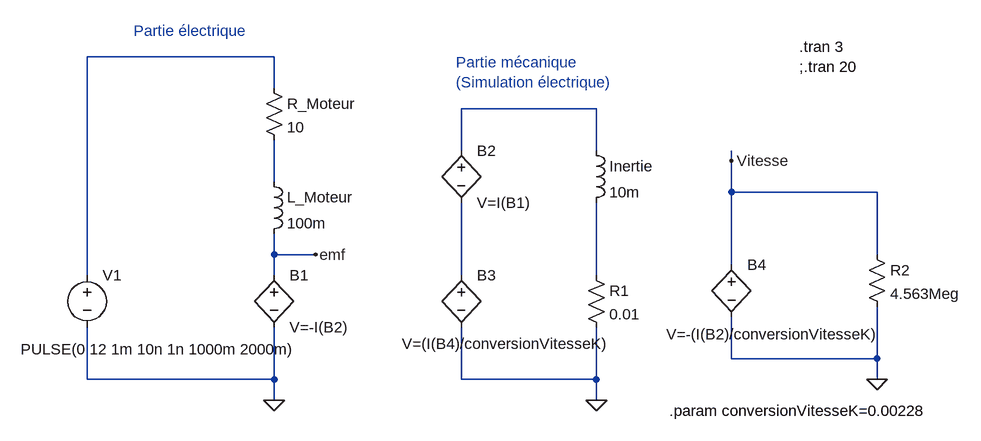
[diagram p0: schematic Moteur_DC.asc]
Moteur_DC.asc, the LTspice schematic file:
Version 4
SHEET 1 1100 680
WIRE 48 48 -240 48
WIRE 48 96 48 48
WIRE 544 128 336 128
WIRE 336 192 336 128
WIRE 544 192 544 128
WIRE 752 208 752 192
WIRE 48 240 48 176
WIRE 752 256 752 208
WIRE 976 256 752 256
WIRE 48 352 48 320
WIRE 112 352 48 352
WIRE 976 352 976 256
WIRE 752 368 752 256
WIRE -240 384 -240 48
WIRE 48 384 48 352
WIRE 336 384 336 272
WIRE 544 384 544 272
WIRE 752 512 752 448
WIRE 976 512 976 432
WIRE 976 512 752 512
WIRE -240 544 -240 464
WIRE 48 544 48 464
WIRE 48 544 -240 544
WIRE 336 544 336 464
WIRE 544 544 544 464
WIRE 544 544 336 544
WIRE 976 544 976 512
WIRE 48 576 48 544
WIRE 544 576 544 544
FLAG 976 544 0
FLAG 544 576 0
FLAG 48 576 0
FLAG 752 208 Vitesse
FLAG 112 352 emf
SYMBOL voltage -240 368 R0
WINDOW 3 -102 130 Left 2
SYMATTR Value PULSE(0 12 1m 10n 1n 1000m 2000m)
SYMATTR InstName V1
SYMBOL bv 48 368 R0
SYMATTR InstName B1
SYMATTR Value V=-I(B2)
SYMBOL bv 336 176 R0
SYMATTR InstName B2
SYMATTR Value V=I(B1)
SYMBOL bv 336 368 R0
WINDOW 3 -91 121 Left 2
SYMATTR Value V=(I(B4)/conversionVitesseK)
SYMATTR InstName B3
SYMBOL bv 752 352 R0
WINDOW 3 -100 123 Left 2
SYMATTR Value V=-(I(B2)/conversionVitesseK)
SYMATTR InstName B4
SYMBOL res 32 80 R0
WINDOW 0 36 40 Left 2
SYMATTR InstName R_Moteur
SYMATTR Value 10
SYMBOL res 528 368 R0
WINDOW 0 36 40 Left 2
SYMATTR InstName R1
SYMATTR Value 0.01
SYMBOL res 960 336 R0
WINDOW 0 36 40 Left 2
SYMATTR InstName R2
SYMATTR Value 4.563Meg
SYMBOL ind 32 224 R0
WINDOW 0 36 40 Left 2
SYMATTR InstName L_Moteur
SYMATTR Value 100m
SYMBOL ind 528 176 R0
WINDOW 0 36 40 Left 2
SYMATTR InstName Inertie
SYMATTR Value 10m
TEXT 656 592 Left 2 !.param conversionVitesseK=0.00228
TEXT -168 8 Left 2 ;Partie électrique
TEXT 328 56 Left 2 ;Partie mécanique\n(Simulation électrique)
TEXT 856 32 Left 2 !.tran 3\n;.tran 20

The netlist it stands for:
* Moteur_DC.asc
V1 N001 0 PULSE(0 12 1m 10n 1n 1000m 2000m)
B1 emf 0 V=-I(B2)
B2 N002 N004 V=I(B1)
B3 N004 0 V=(I(B4)/conversionVitesseK)
B4 Vitesse 0 V=-(I(B2)/conversionVitesseK)
R_Moteur N001 N003 10
R1 N005 0 0.01
R2 Vitesse 0 4.563Meg
L_Moteur N003 emf 100m
L§Inertie N002 N005 10m
.param conversionVitesseK=0.00228
* Partie électrique
* Partie mécanique
* (Simulation électrique)
.tran 3
;.tran 20
.backanno
.end